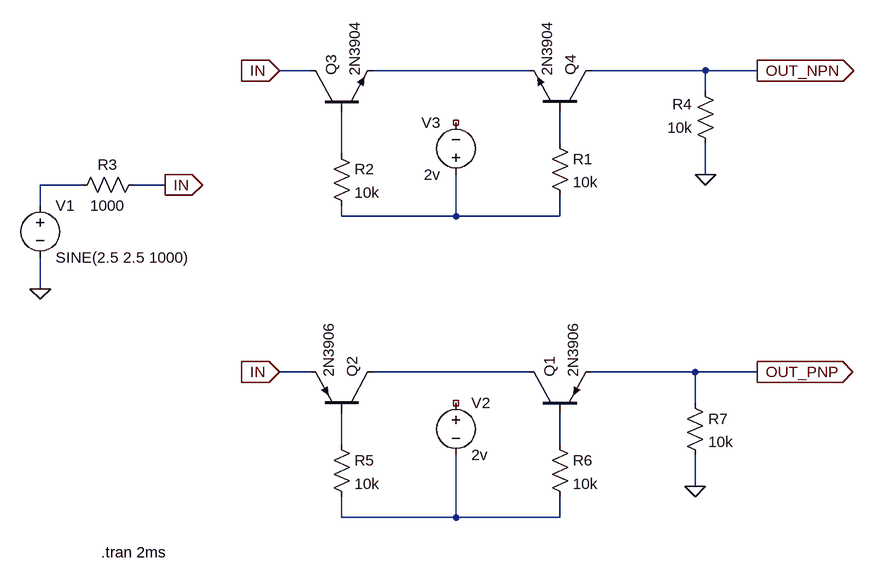
[diagram p0: schematic Dual_emitter_NPN_PNP_switch.asc]
Dual_emitter_NPN_PNP_switch.asc, the LTspice schematic file:
Version 4
SHEET 1 924 900
WIRE -16 128 -64 128
WIRE 320 128 80 128
WIRE 592 128 416 128
WIRE 672 128 592 128
WIRE 592 160 592 128
WIRE 368 240 368 192
WIRE 32 256 32 192
WIRE 592 288 592 240
WIRE -368 304 -432 304
WIRE -240 304 -288 304
WIRE -432 336 -432 304
WIRE 32 352 32 336
WIRE 208 352 208 288
WIRE 208 352 32 352
WIRE 368 352 368 320
WIRE 368 352 208 352
WIRE -432 464 -432 416
WIRE -16 592 -64 592
WIRE 320 592 80 592
WIRE 576 592 416 592
WIRE 672 592 576 592
WIRE 576 640 576 592
WIRE 32 704 32 656
WIRE 368 704 368 656
WIRE 576 768 576 720
WIRE 32 816 32 784
WIRE 208 816 208 720
WIRE 208 816 32 816
WIRE 368 816 368 784
WIRE 368 816 208 816
FLAG -432 464 0
FLAG 592 288 0
FLAG 672 128 OUT_NPN
IOPIN 672 128 Out
FLAG -240 304 IN
IOPIN -240 304 Out
FLAG -64 128 IN
IOPIN -64 128 In
FLAG -64 592 IN
IOPIN -64 592 In
FLAG 576 768 0
FLAG 672 592 OUT_PNP
IOPIN 672 592 Out
SYMBOL res 352 224 R0
SYMATTR InstName R1
SYMATTR Value 10k
SYMBOL res 16 240 R0
SYMATTR InstName R2
SYMATTR Value 10k
SYMBOL res -272 288 R90
WINDOW 0 0 56 VBottom 2
WINDOW 3 32 56 VTop 2
SYMATTR InstName R3
SYMATTR Value 1000
SYMBOL res 608 256 R180
WINDOW 0 36 76 Left 2
WINDOW 3 36 40 Left 2
SYMATTR InstName R4
SYMATTR Value 10k
SYMBOL voltage -432 320 R0
WINDOW 123 0 0 Left 0
WINDOW 39 0 0 Left 0
SYMATTR InstName V1
SYMATTR Value SINE(2.5 2.5 1000)
SYMBOL npn -16 192 R270
SYMATTR InstName Q3
SYMATTR Value 2N3904
SYMBOL npn 416 192 M270
SYMATTR InstName Q4
SYMATTR Value 2N3904
SYMBOL voltage 208 304 R180
WINDOW 0 24 96 Left 2
WINDOW 3 24 16 Left 2
WINDOW 123 0 0 Left 0
WINDOW 39 0 0 Left 0
SYMATTR InstName V3
SYMATTR Value 2v
SYMBOL pnp 320 656 R270
SYMATTR InstName Q1
SYMATTR Value 2N3906
SYMBOL pnp 80 656 M270
SYMATTR InstName Q2
SYMATTR Value 2N3906
SYMBOL voltage 208 624 R0
WINDOW 123 0 0 Left 0
WINDOW 39 0 0 Left 0
SYMATTR InstName V2
SYMATTR Value 2v
SYMBOL res 16 688 R0
SYMATTR InstName R5
SYMATTR Value 10k
SYMBOL res 352 688 R0
SYMATTR InstName R6
SYMATTR Value 10k
SYMBOL res 560 624 R0
SYMATTR InstName R7
SYMATTR Value 10k
TEXT -338 870 Left 2 !.tran 2ms

The netlist it stands for:
* Dual_emitter_NPN_PNP_switch.asc
R1 N002 N005 10k
R2 N003 N005 10k
R3 IN N004 1000
R4 0 OUT_NPN 10k
V1 N004 0 SINE(2.5 2.5 1000)
Q3 IN N003 N001 0 2N3904
Q4 OUT_NPN N002 N001 0 2N3904
V3 N005 NC_01 2v
Q1 N006 N008 OUT_PNP 0 2N3906
Q2 N006 N007 IN 0 2N3906
V2 NC_02 N009 2v
R5 N007 N009 10k
R6 N008 N009 10k
R7 OUT_PNP 0 10k
.model NPN NPN
.model PNP PNP
.lib standard.bjt
.tran 2ms
.backanno
.end